# Altium schematic sheet Master.SchDoc: Master
size A4; DrawnBy: M. Small & J. Wilson; SheetNumber: 1; SheetTotal: 10
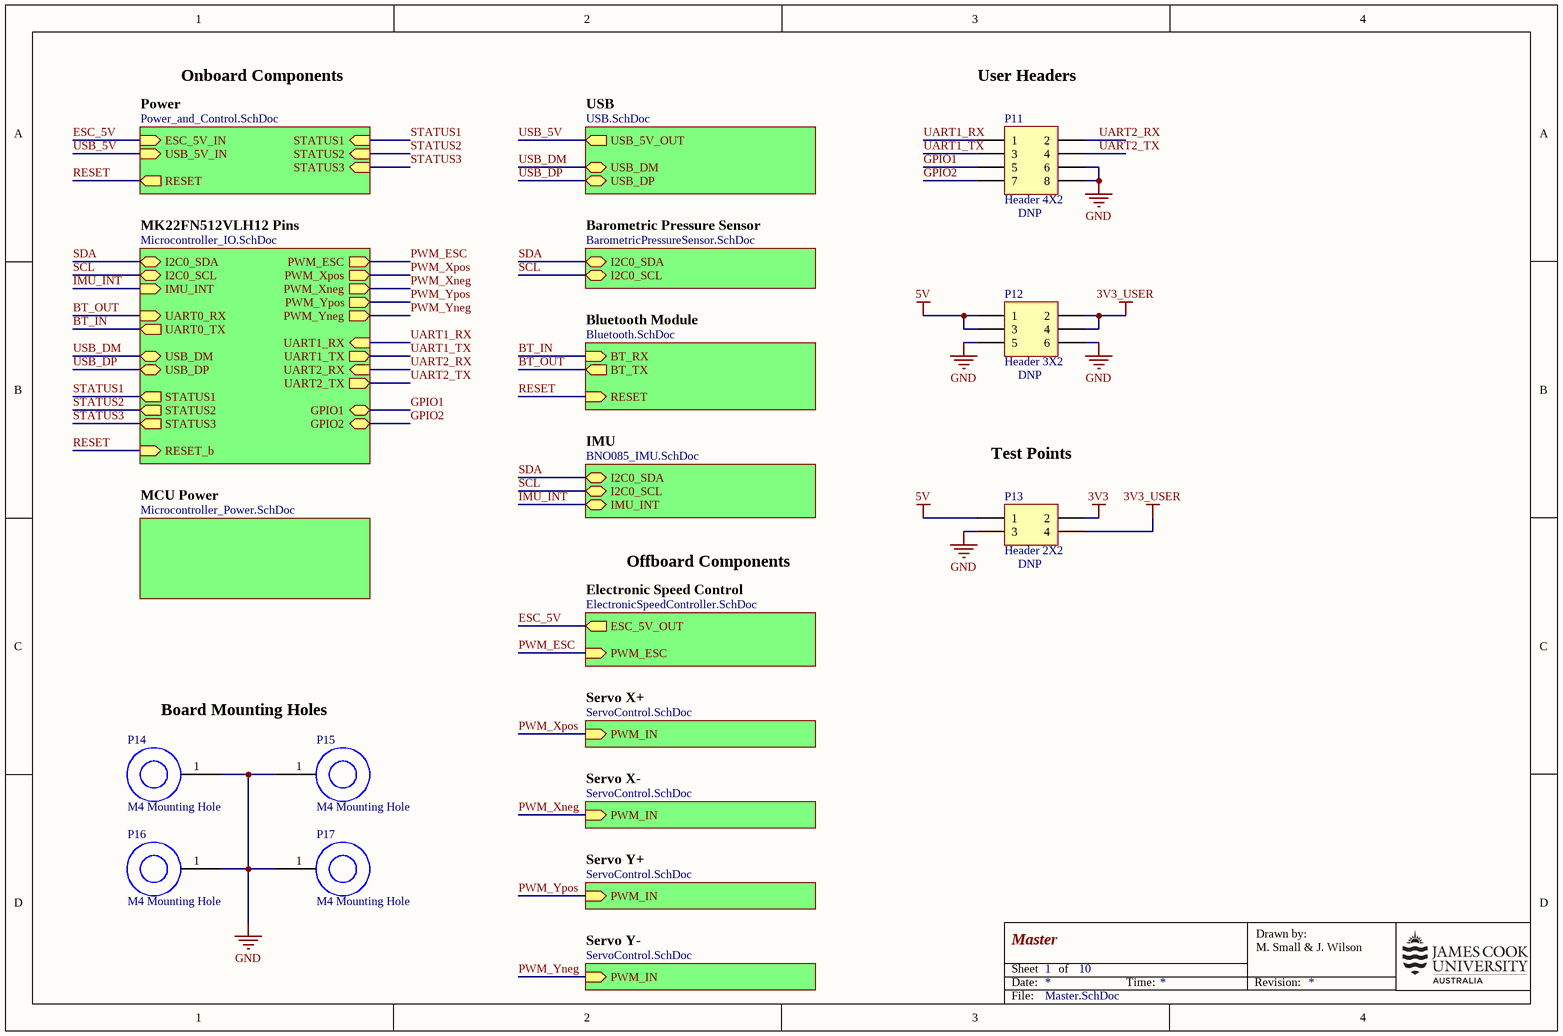
[diagram p0: Master.SchDoc]

## Parts
P11  Header 4X2  [HDR2X4]
P12  Header 3X2  [HDR2X3]
P13  Header 2X2  [HDR2X2]
P14  M4 Mounting Hole  [M4 Mounting Hole]
P15  M4 Mounting Hole  [M4 Mounting Hole]
P16  M4 Mounting Hole  [M4 Mounting Hole]
P17  M4 Mounting Hole  [M4 Mounting Hole]

## Sub-sheets
Barometric Pressure Sensor = BarometricPressureSensor.SchDoc: I2C0_SDA (bidir), I2C0_SCL (bidir)
Bluetooth Module = Bluetooth.SchDoc: BT_RX (in), BT_TX (out), RESET (in)
Electronic Speed Control = ElectronicSpeedController.SchDoc: PWM_ESC (in), ESC_5V_OUT (out)
IMU = BNO085_IMU.SchDoc: I2C0_SDA (bidir), I2C0_SCL (bidir), IMU_INT (bidir)
MCU Power = Microcontroller_Power.SchDoc: no entries
MK22FN512VLH12 Pins = Microcontroller_IO.SchDoc: I2C0_SCL (bidir), I2C0_SDA (bidir), UART0_RX (in), UART1_TX (out), UART2_RX (in), UART1_RX (in), UART0_TX (out), UART2_TX (out), USB_DM (bidir), USB_DP (bidir), IMU_INT (in), PWM_ESC (out), PWM_Xpos (out), PWM_Yneg (out), PWM_Ypos (out), PWM_Xneg (out), RESET_b (in), STATUS2 (out), STATUS3 (out), STATUS1 (out), GPIO2 (bidir), GPIO1 (bidir)
Power = Power_and_Control.SchDoc: USB_5V_IN (in), ESC_5V_IN (in), RESET (out), STATUS1 (in), STATUS2 (in), STATUS3 (in)
Servo X+ = ServoControl.SchDoc: PWM_IN (in)
Servo X- = ServoControl.SchDoc: PWM_IN (in)
Servo Y+ = ServoControl.SchDoc: PWM_IN (in)
Servo Y- = ServoControl.SchDoc: PWM_IN (in)
USB = USB.SchDoc: USB_DM (bidir), USB_DP (bidir), USB_5V_OUT (out)

## Nets
3V3: P13.2
3V3_USER: P12.2 P12.4 P13.4
5V: P12.1 P12.3 P13.1
GND: P11.6 P11.8 P12.5 P12.6 P13.3 P14.1 P15.1 P16.1 P17.1
BT_IN: sheet MK22FN512VLH12 Pins/UART0_TX, sheet Bluetooth Module/BT_RX
BT_OUT: sheet MK22FN512VLH12 Pins/UART0_RX, sheet Bluetooth Module/BT_TX
ESC_5V: sheet Power/ESC_5V_IN, sheet Electronic Speed Control/ESC_5V_OUT
GPIO1: P11.5 ; sheet MK22FN512VLH12 Pins/GPIO1
GPIO2: P11.7 ; sheet MK22FN512VLH12 Pins/GPIO2
IMU_INT: sheet MK22FN512VLH12 Pins/IMU_INT, sheet IMU/IMU_INT
PWM_ESC: sheet MK22FN512VLH12 Pins/PWM_ESC, sheet Electronic Speed Control/PWM_ESC
PWM_Xneg: sheet MK22FN512VLH12 Pins/PWM_Xneg, sheet Servo X-/PWM_IN
PWM_Xpos: sheet MK22FN512VLH12 Pins/PWM_Xpos, sheet Servo X+/PWM_IN
PWM_Yneg: sheet MK22FN512VLH12 Pins/PWM_Yneg, sheet Servo Y-/PWM_IN
PWM_Ypos: sheet MK22FN512VLH12 Pins/PWM_Ypos, sheet Servo Y+/PWM_IN
RESET: sheet MK22FN512VLH12 Pins/RESET_b, sheet Power/RESET, sheet Bluetooth Module/RESET
SCL: sheet MK22FN512VLH12 Pins/I2C0_SCL, sheet Barometric Pressure Sensor/I2C0_SCL, sheet IMU/I2C0_SCL
SDA: sheet MK22FN512VLH12 Pins/I2C0_SDA, sheet Barometric Pressure Sensor/I2C0_SDA, sheet IMU/I2C0_SDA
STATUS1: sheet MK22FN512VLH12 Pins/STATUS1, sheet Power/STATUS1
STATUS2: sheet MK22FN512VLH12 Pins/STATUS2, sheet Power/STATUS2
STATUS3: sheet MK22FN512VLH12 Pins/STATUS3, sheet Power/STATUS3
UART1_RX: P11.1 ; sheet MK22FN512VLH12 Pins/UART1_RX
UART1_TX: P11.3 ; sheet MK22FN512VLH12 Pins/UART1_TX
UART2_RX: P11.2 ; sheet MK22FN512VLH12 Pins/UART2_RX
UART2_TX: P11.4 ; sheet MK22FN512VLH12 Pins/UART2_TX
USB_5V: sheet Power/USB_5V_IN, sheet USB/USB_5V_OUT
USB_DM: sheet MK22FN512VLH12 Pins/USB_DM, sheet USB/USB_DM
USB_DP: sheet MK22FN512VLH12 Pins/USB_DP, sheet USB/USB_DP

## Notes on the sheet
- Onboard Components
- User Headers
- (near P11) DNP
- (near P12) DNP
- Test Points
- Offboard Components
- (near P13) DNP
- Board Mounting Holes
- Labels drawn without touching a wire or pin: \
- Date:
- Sheet
- of
- Time:
- Revision:
- Drawn by:
- File:

## Library data of the parts
P11 = Header 4X2: Header, 4-Pin, Dual row; LatestRevisionDate: 17-Jul-2002; LatestRevisionNote: Re-released for DXP Platform.; Publisher: Altium Limited
P12 = Header 3X2: Header, 3-Pin, Dual row; LatestRevisionDate: 17-Jul-2002; LatestRevisionNote: Re-released for DXP Platform.; Publisher: Altium Limited
P13 = Header 2X2: Header, 2-Pin, Dual row; LatestRevisionDate: 17-Jul-2002; LatestRevisionNote: Re-released for DXP Platform.; Publisher: Altium Limited
P14-P17 = M4 Mounting Hole: M4 Mounting Hole, ID 3.62mm